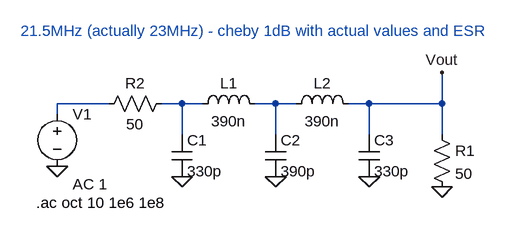
[diagram p0: schematic band4_cheby.asc]
band4_cheby.asc, the LTspice schematic file:
Version 4
SHEET 1 1032 680
WIRE -64 80 -144 80
WIRE 48 80 16 80
WIRE 80 80 48 80
WIRE 192 80 160 80
WIRE 224 80 192 80
WIRE 336 80 304 80
WIRE 448 80 448 32
WIRE 448 80 336 80
WIRE -144 96 -144 80
WIRE 48 128 48 80
WIRE 192 128 192 80
WIRE 336 128 336 80
WIRE 448 128 448 80
FLAG 48 192 0
FLAG 192 192 0
FLAG 336 192 0
FLAG 448 208 0
FLAG -144 176 0
FLAG 448 32 Vout
SYMBOL ind 64 96 R270
WINDOW 0 32 56 VTop 2
WINDOW 3 5 56 VBottom 2
SYMATTR InstName L1
SYMATTR Value 390n
SYMATTR SpiceLine Rser=0.33
SYMBOL ind 208 96 R270
WINDOW 0 32 56 VTop 2
WINDOW 3 5 56 VBottom 2
SYMATTR InstName L2
SYMATTR Value 390n
SYMATTR SpiceLine Rser=0.33
SYMBOL cap 32 128 R0
SYMATTR InstName C1
SYMATTR Value 330p
SYMATTR SpiceLine Rser=0.1
SYMBOL cap 176 128 R0
SYMATTR InstName C2
SYMATTR Value 390p
SYMATTR SpiceLine Rser=0.1
SYMBOL cap 320 128 R0
SYMATTR InstName C3
SYMATTR Value 330p
SYMATTR SpiceLine Rser=0.1
SYMBOL res 432 112 R0
SYMATTR InstName R1
SYMATTR Value 50
SYMBOL res -80 96 R270
WINDOW 0 32 56 VTop 2
WINDOW 3 0 56 VBottom 2
SYMATTR InstName R2
SYMATTR Value 50
SYMBOL voltage -144 80 R0
WINDOW 123 24 124 Left 2
WINDOW 39 0 0 Left 2
SYMATTR Value2 AC 1
SYMATTR InstName V1
SYMATTR Value ""
TEXT -176 232 Left 2 !.ac oct 10 1e6 1e8
TEXT -200 -32 Left 2 ;21.5MHz (actually 23MHz) - cheby 1dB with actual values and ESR

The netlist it stands for:
* band4_cheby.asc
L1 N002 N003 390n Rser=0.33
L2 N003 Vout 390n Rser=0.33
C1 N002 0 330p Rser=0.1
C2 N003 0 390p Rser=0.1
C3 Vout 0 330p Rser=0.1
R1 Vout 0 50
R2 N001 N002 50
V1 N001 0 AC 1
.ac oct 10 1e6 1e8
* 21.5MHz (actually 23MHz) - cheby 1dB with actual values and ESR
.backanno
.end